# EAGLE design 524_joystick_serial (EAGLE 9.6.2)
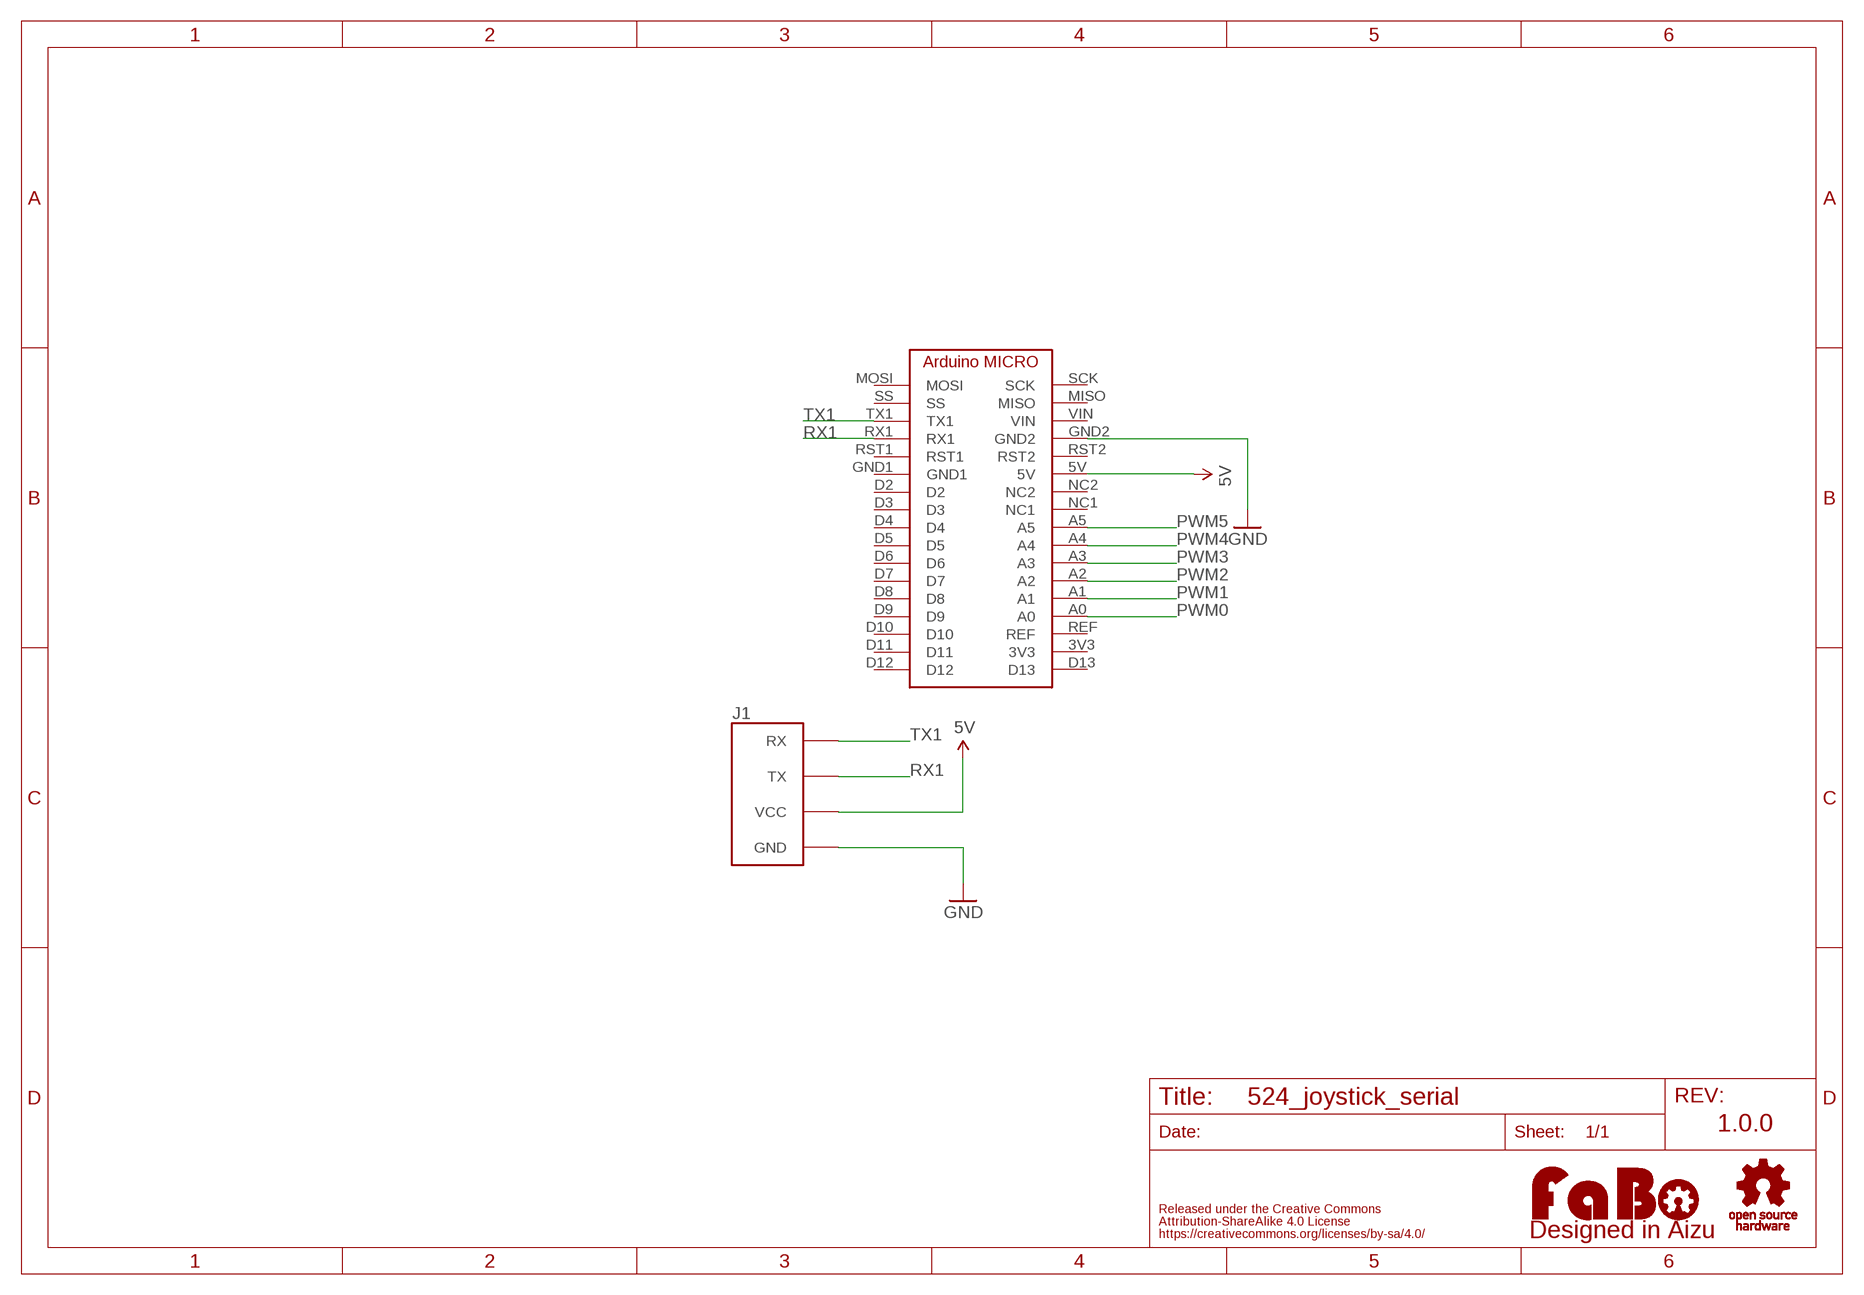
[diagram p0: schematic, sheet 1]

## Parts
J1  FABO_BRICK_SERIAL-B04B-PASK-1  [FABO_BRICK_SERIAL_B04B-PASK-1]
LOGO1  LOGO_FABO-M_BOTTOM  [LOGO_FABO_M_BOTTOM]
U$2  ARDUINO_MICRO  [ARDUINO_MICRO]
U$3  LOGO_OSHW-M_BOTTOM  [LOGO_OSHW_M_BOTTOM]

## Nets
5V: J1.VCC U$2.5V
GND: J1.GND U$2.GND2
PWM0: U$2.A0
PWM1: U$2.A1
PWM2: U$2.A2
PWM3: U$2.A3
PWM4: U$2.A4
PWM5: U$2.A5
RX1: J1.TX U$2.RX1
TX1: J1.RX U$2.TX1
Unconnected: U$2.3V3 U$2.D2 U$2.D3 U$2.D4 U$2.D5 U$2.D6 U$2.D7 U$2.D8 U$2.D9 U$2.D10 U$2.D11 U$2.D12 U$2.D13 U$2.GND1 U$2.MISO U$2.MOSI U$2.NC1 U$2.NC2 U$2.REF U$2.RST1 U$2.RST2 U$2.SCK U$2.SS U$2.VIN

## Notes on the sheet
- 1.0.0

## Library data of the parts
J1 = FaBo-Template:FABO_BRICK_SERIAL: FaBo Brick Serial
LOGO1 = component:LOGO_FABO
U$2 = FaBo-Boards:ARDUINO_MICRO
U$3 = component:LOGO_OSHW

## Board
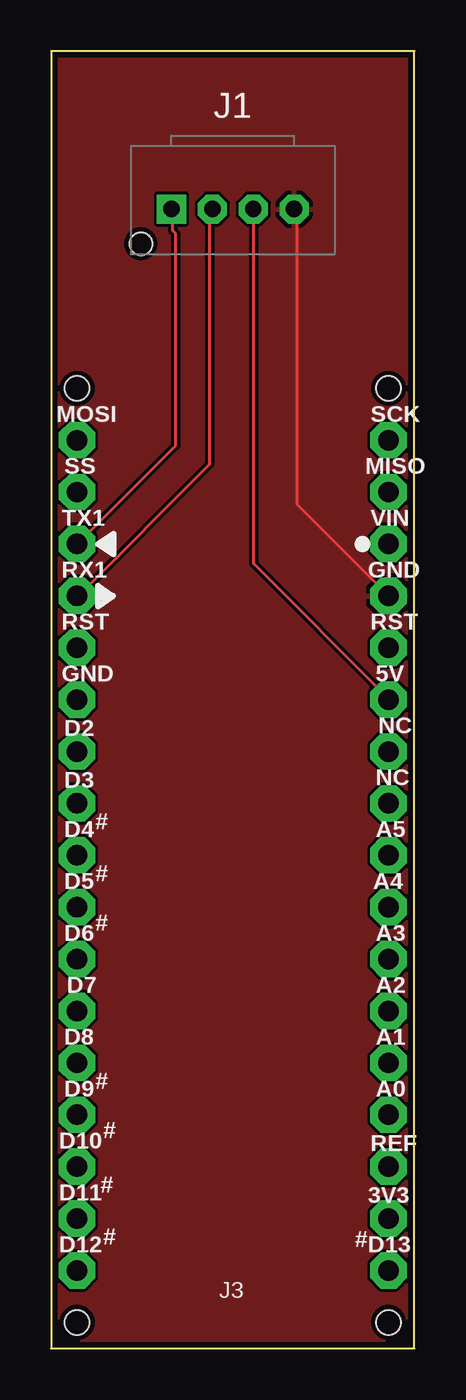
[diagram p1: board, top side]
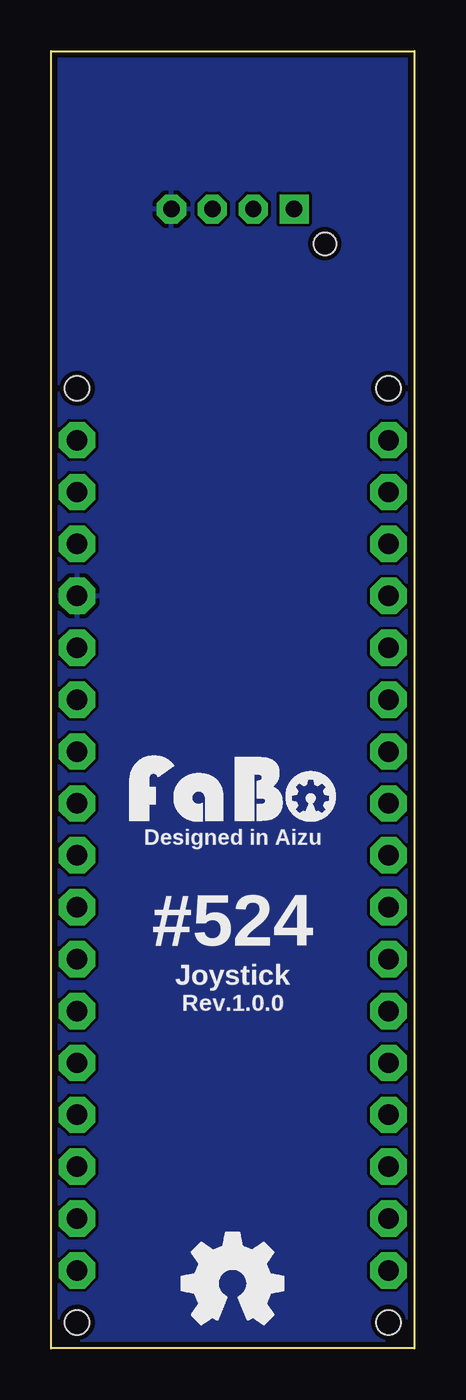
[diagram p2: board, bottom side, seen from below]

Size 17.78 x 63.5 mm. Coordinates in mm from the lower left corner, seen from the top.
Copper layers (1*16): Top 0.035mm / dielectric 1.6mm / Bottom 0.035mm
Design rules "PCBway": minimum track width 6mil, minimum drill 12mil, track to track 6mil, track to pad 6mil, pad to pad 6mil, via to via 6mil, smd to smd 6mil, copper to edge 10mil, drill to drill 10mil, minimum pad ring 10mil, minimum via ring 6mil, stop-mask expansion 2mil, vias tented up to drill 100mil, thermal gap 8mil

### Footprints (pad centres in the part's own frame; a part is rotated, then mirrored left to right if it is on the bottom)
FABO_BRICK_SERIAL_B04B-PASK-1 = drill 0.8 pad 1.422 octagon: GND -3,0; TX 1,0; VCC -1,0 | drill 0.8 pad 1.422 square: RX 3,0 | hole 1.1: 4.5,1.7
ARDUINO_MICRO = drill 1 pad 1.778 octagon: 3V3 16.51,6.35; 5V 16.51,31.75; A0 16.51,11.43; A1 16.51,13.97; A2 16.51,16.51; A3 16.51,19.05; A4 16.51,21.59; A5 16.51,24.13; D2 1.27,29.21; D3 1.27,26.67; D4 1.27,24.13; D5 1.27,21.59; D6 1.27,19.05; D7 1.27,16.51; D8 1.27,13.97; D9 1.27,11.43; D10 1.27,8.89; D11 1.27,6.35; D12 1.27,3.81; D13 16.51,3.81; GND1 1.27,31.75; GND2 16.51,36.83; MISO 16.51,41.91; MOSI 1.27,44.45; NC1 16.51,26.67; NC2 16.51,29.21; REF 16.51,8.89; RST1 1.27,34.29; RST2 16.51,34.29; RX1 1.27,36.83; SCK 16.51,44.45; SS 1.27,41.91; TX1 1.27,39.37; VIN 16.51,39.37 | hole 1.2: 1.27,1.264; 16.51,1.264; 1.27,46.984; 16.51,46.984

### Placement (x,y rotation side)
J1  8.89,55.77 180 top
LOGO1  8.89,25.41 0 top
U$2  0,0.01 0 top
U$3  8.89,3.18 0 top

### Tracks (layer width: path | path; a pad name or v marks a point on that pad's centre or on a via)
5V
  Top 0.152: J1.VCC 9.91,55.63 9.91,38.41 16.46,31.86 U$2.5V
GND
  Top 0.152: U$2.GND2 12.04,41.31 12.04,55.63 J1.GND
  pour Bottom: 0,0.01 0,63.76 18.75,63.76 18.75,0.01
  pour Top: 0,0.01 0,63.76 18.75,63.76 18.75,0.01
RX1
  Top 0.152: J1.TX 7.77,55.63 7.77,43.29 1.37,36.89 U$2.RX1
TX1
  Top 0.152: U$2.TX1 6.1,44.2 6.1,54.57 5.94,54.72 5.94,55.63 J1.RX

### Text on the board
bPlace: Designed in Aizu | #524 | Joystick | Rev.1.0.0